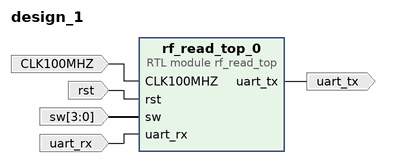
[diagram p0: block diagram of the top level]
# Vivado block design design_1, xc7s50csga324-1, Vivado 2023.2
create_bd_design design_1

create_bd_port -dir I -type clk CLK100MHZ
set_property -dict {CONFIG.FREQ_HZ 100000000} [get_bd_ports CLK100MHZ]
create_bd_port -dir I -type rst rst
set_property -dict {CONFIG.POLARITY ACTIVE_HIGH} [get_bd_ports rst]
create_bd_port -dir I -from 3 -to 0 -type data sw
create_bd_port -dir I uart_rx
create_bd_port -dir O uart_tx

create_bd_cell -type module -reference rf_read_top rf_read_top_0

# ---- connections ----

connect_bd_net [get_bd_ports CLK100MHZ] [get_bd_pins rf_read_top_0/CLK100MHZ]
connect_bd_net [get_bd_pins rf_read_top_0/uart_tx] [get_bd_ports uart_tx]
connect_bd_net [get_bd_ports rst] [get_bd_pins rf_read_top_0/rst]
connect_bd_net [get_bd_ports sw] [get_bd_pins rf_read_top_0/sw]
connect_bd_net [get_bd_ports uart_rx] [get_bd_pins rf_read_top_0/uart_rx]

validate_bd_design
save_bd_design
